# Altium project Funkcijski_generator.PrjPcb
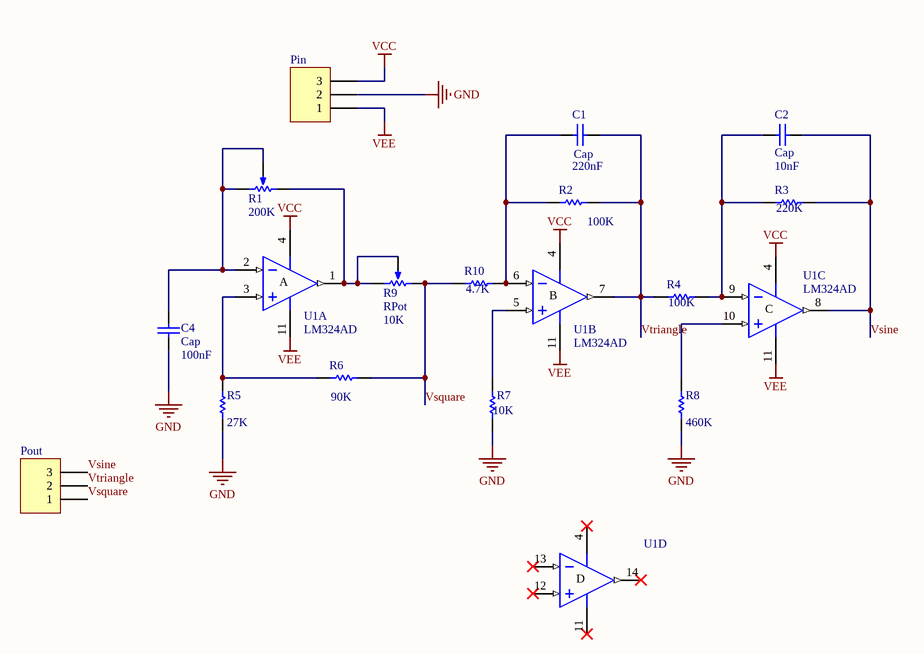
[diagram p0: Funkcijski_generator_sema.SchDoc]
1 sheet, 16 parts. Net scope: global (net labels, ports and power ports of the same name join across sheets).
Board file: Funkcijski_generator_pcb.PcbDoc

## Sheet Funkcijski_generator_sema.SchDoc
size A4

### Parts
C1  Cap  value 220nF  [RAD-0.3]
C2  Cap  value 10nF  [RAD-0.3]
C4  Cap  value 100nF  [RAD-0.3]
Pin  Header 3  [HDR1X3]  (value not drawn)
Pout  Header 3  [HDR1X3]  (value not drawn)
R1  value 200K  [VR5]  (hidden comment: RPot)
R2  value 100K  [AXIAL-0.3]  (hidden comment: Res1)
R3  value 220K  [AXIAL-0.3]  (hidden comment: Res1)
R4  value 100K  [AXIAL-0.3]  (hidden comment: Res1)
R5  value 27K  [AXIAL-0.3]  (hidden comment: Res1)
R6  value 90K  [AXIAL-0.3]  (hidden comment: Res1)
R7  value 10K  [AXIAL-0.3]  (hidden comment: Res1)
R8  value 460K  [AXIAL-0.3]  (hidden comment: Res1)
R9  RPot  value 10K  [VR5]
R10  value 4.7K  [AXIAL-0.3]  (hidden comment: Res1)
U1  LM324AD  [DIP-14]  (parts A,B,C,D of 4)

### Nets
GND: C4.1 Pin.2 R5.1 R7.1 R8.1
VCC: Pin.3 U1.4(V+)
VEE: Pin.1 U1.11(V-)
Vsine: C2.1 Pout.3 R3.2 U1.8(OUT)
Vsquare: Pout.1 R6.2 R9.1(TOP) R10.1
Vtriangle: C1.1 Pout.2 R2.2 R4.1 U1.7(OUT)
NetC1_2: C1.2 R2.1 R10.2 U1.6(IN-)
NetC2_2: C2.2 R3.1 R4.2 U1.9(IN-)
NetC4_2: C4.2 R1.2(BOT) R1.3(TAP) U1.2(IN-)
NetR1_1: R1.1(TOP) R9.2(BOT) R9.3(TAP) U1.1(OUT)
NetR5_2: R5.2 R6.1 U1.3(IN+)
NetR7_2: R7.2 U1.5(IN+)
NetR8_2: R8.2 U1.10(IN+)

Not connected (* = marked no-connect by the designer): U1 12(IN+)* 13(IN-)* 14(OUT)*

### Notes on the sheet
- (in symbol LM324AD, part A) A
- (in symbol LM324AD, part B) B
- (in symbol LM324AD, part C) C
- (in symbol LM324AD, part D) D

### Library data of the parts
C1 C2 C4 = Cap: Capacitor; Published: 8-Jun-2000; LatestRevisionDate: 17-Jul-2002; LatestRevisionNote: Re-released for DXP Platform.; PackageReference: RAD-0.3; Publisher: Altium Limited; PackageDescription: Radial Cap, Thru-Hole; 2 Leads; 0.3 in Pin Spacing
Pin Pout = Header 3: Header, 3-Pin; LatestRevisionDate: 17-Jul-2002; LatestRevisionNote: Re-released for DXP Platform.; Publisher: Altium Limited
R1 R9 = RPot: Potentiometer; Sim Note: Enter the Resistance value and the set point into parameter fields.; Set Position: 0.5; Published: 8-Jun-2000; LatestRevisionDate: 17-Jul-2002; LatestRevisionNote: Re-released for DXP Platform.; PackageReference: VR5; Publisher: Altium Limited; PackageDescription: Variable Resistor, Thru-Hole; 3 Leads
R2-R8 R10 = Res1: Resistor; Published: 8-Jun-2000; LatestRevisionDate: 17-Jul-2002; LatestRevisionNote: Re-released for DXP Platform.; PackageReference: AXIAL-0.3; Publisher: Altium Limited; PackageDescription: Axial Device, Thru-Hole; 2 Leads; 0.3 in Pin Spacing
U1 = LM324AD: Low-Power Quad Operational Amplifier; Published: 24-Aug-2001; LatestRevisionDate: 13-Apr-2006; LatestRevisionNote: IPC-7351 Footprint Added.; DatasheetVersion: Nov-1997; PackageVersion: Sep-1998; PackageReference: SO14; Publisher: Altium Limited; PackageDescription: 14-Pin Small Outline Integrated Circuit 1.27 mm Pitch; Code_IPC: SOIC127P600-14; ComponentLink1Description: Manufacturer Link; ComponentLink1URL: http://www.st.com/; ComponentLink2Description: Datasheet; ComponentLink2URL: http://www.st.com/stonline/products/literature/ds/4797/lm224a.pdf